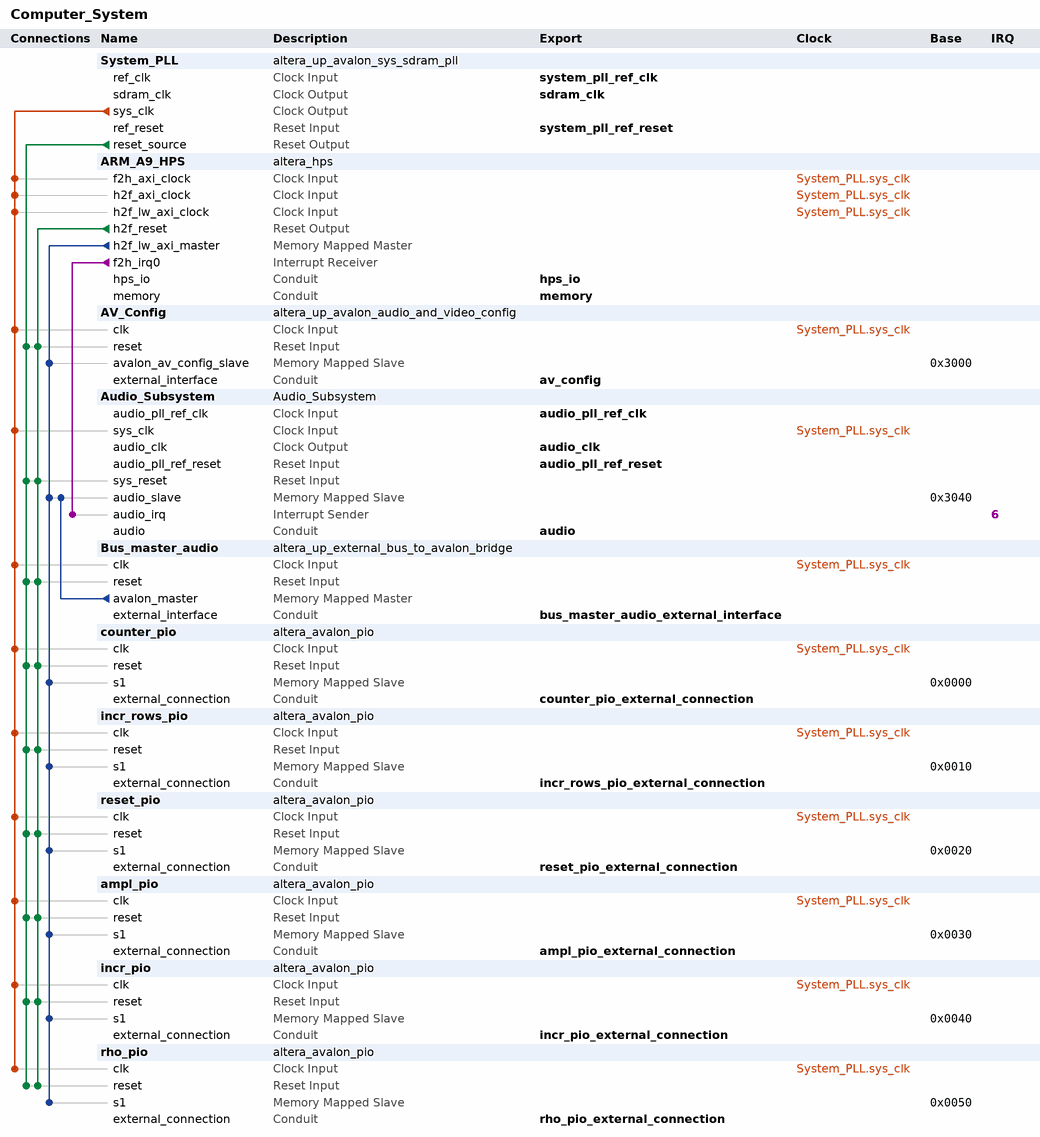
[diagram p0: system contents]
# Platform Designer (Qsys) system Computer_System, Cyclone V 5CSEMA5F31C6
# Parameters at their usual value, and those the tool derives, are not listed.
package require -exact qsys 18.1
create_system Computer_System
set_project_property DEVICE_FAMILY {Cyclone V}
set_project_property DEVICE 5CSEMA5F31C6

add_instance System_PLL altera_up_avalon_sys_sdram_pll 18.0
set_instance_parameter_value System_PLL CV_boards DE1-SoC
set_instance_parameter_value System_PLL gui_outclk 100.0
set_instance_parameter_value System_PLL gui_refclk 50.0

add_instance ARM_A9_HPS altera_hps 18.1
set_instance_parameter_value ARM_A9_HPS EMAC1_Mode RGMII
set_instance_parameter_value ARM_A9_HPS EMAC1_PinMuxing {HPS I/O Set 0}
set_instance_parameter_value ARM_A9_HPS F2SCLK_COLDRST_Enable false
set_instance_parameter_value ARM_A9_HPS F2SCLK_DBGRST_Enable false
set_instance_parameter_value ARM_A9_HPS F2SCLK_WARMRST_Enable false
set_instance_parameter_value ARM_A9_HPS F2SINTERRUPT_Enable true
set_instance_parameter_value ARM_A9_HPS F2S_Width 2
set_instance_parameter_value ARM_A9_HPS FPGA_PERIPHERAL_OUTPUT_CLOCK_FREQ_EMAC0_GTX_CLK 125
set_instance_parameter_value ARM_A9_HPS FPGA_PERIPHERAL_OUTPUT_CLOCK_FREQ_EMAC0_MD_CLK 100.0
set_instance_parameter_value ARM_A9_HPS FPGA_PERIPHERAL_OUTPUT_CLOCK_FREQ_EMAC1_GTX_CLK 125
set_instance_parameter_value ARM_A9_HPS FPGA_PERIPHERAL_OUTPUT_CLOCK_FREQ_EMAC1_MD_CLK 100.0
set_instance_parameter_value ARM_A9_HPS HPS_PROTOCOL DDR3
set_instance_parameter_value ARM_A9_HPS I2C0_Mode I2C
set_instance_parameter_value ARM_A9_HPS I2C0_PinMuxing {HPS I/O Set 0}
set_instance_parameter_value ARM_A9_HPS I2C1_Mode I2C
set_instance_parameter_value ARM_A9_HPS I2C1_PinMuxing {HPS I/O Set 0}
set_instance_parameter_value ARM_A9_HPS LWH2F_Enable true
set_instance_parameter_value ARM_A9_HPS MEM_BANKADDR_WIDTH 3
set_instance_parameter_value ARM_A9_HPS MEM_CLK_FREQ 400.0
set_instance_parameter_value ARM_A9_HPS MEM_COL_ADDR_WIDTH 10
set_instance_parameter_value ARM_A9_HPS MEM_DQ_WIDTH 32
set_instance_parameter_value ARM_A9_HPS MEM_DRV_STR RZQ/7
set_instance_parameter_value ARM_A9_HPS MEM_ROW_ADDR_WIDTH 15
set_instance_parameter_value ARM_A9_HPS MEM_RTT_NOM RZQ/4
set_instance_parameter_value ARM_A9_HPS MEM_RTT_WR RZQ/4
set_instance_parameter_value ARM_A9_HPS MEM_TCL 11
set_instance_parameter_value ARM_A9_HPS MEM_TFAW_NS 30.0
set_instance_parameter_value ARM_A9_HPS MEM_TRAS_NS 35.0
set_instance_parameter_value ARM_A9_HPS MEM_TRCD_NS 13.75
set_instance_parameter_value ARM_A9_HPS MEM_TRFC_NS 260.0
set_instance_parameter_value ARM_A9_HPS MEM_TRP_NS 13.75
set_instance_parameter_value ARM_A9_HPS MEM_VENDOR JEDEC
set_instance_parameter_value ARM_A9_HPS MEM_WTCL 8
set_instance_parameter_value ARM_A9_HPS QSPI_Mode {1 SS}
set_instance_parameter_value ARM_A9_HPS QSPI_PinMuxing {HPS I/O Set 0}
set_instance_parameter_value ARM_A9_HPS REF_CLK_FREQ 25.0
set_instance_parameter_value ARM_A9_HPS S2FCLK_USER2CLK 5
set_instance_parameter_value ARM_A9_HPS S2F_Width 3
set_instance_parameter_value ARM_A9_HPS SDIO_Mode {4-bit Data}
set_instance_parameter_value ARM_A9_HPS SDIO_PinMuxing {HPS I/O Set 0}
set_instance_parameter_value ARM_A9_HPS SPIM1_Mode {Single Slave Select}
set_instance_parameter_value ARM_A9_HPS SPIM1_PinMuxing {HPS I/O Set 0}
set_instance_parameter_value ARM_A9_HPS STM_Enable false
set_instance_parameter_value ARM_A9_HPS TIMING_BOARD_AC_SKEW 0.03
set_instance_parameter_value ARM_A9_HPS TIMING_BOARD_AC_TO_CK_SKEW 0.0
set_instance_parameter_value ARM_A9_HPS TIMING_BOARD_DQ_TO_DQS_SKEW 0.0
set_instance_parameter_value ARM_A9_HPS TIMING_BOARD_MAX_CK_DELAY 0.03
set_instance_parameter_value ARM_A9_HPS TIMING_BOARD_MAX_DQS_DELAY 0.02
set_instance_parameter_value ARM_A9_HPS TIMING_BOARD_SKEW_BETWEEN_DQS 0.08
set_instance_parameter_value ARM_A9_HPS TIMING_BOARD_SKEW_CKDQS_DIMM_MAX 0.16
set_instance_parameter_value ARM_A9_HPS TIMING_BOARD_SKEW_CKDQS_DIMM_MIN 0.09
set_instance_parameter_value ARM_A9_HPS TIMING_BOARD_SKEW_WITHIN_DQS 0.01
set_instance_parameter_value ARM_A9_HPS TIMING_TDH 65
set_instance_parameter_value ARM_A9_HPS TIMING_TDQSCK 255
set_instance_parameter_value ARM_A9_HPS TIMING_TDQSQ 125
set_instance_parameter_value ARM_A9_HPS TIMING_TDS 30
set_instance_parameter_value ARM_A9_HPS TIMING_TIH 140
set_instance_parameter_value ARM_A9_HPS TIMING_TIS 180
set_instance_parameter_value ARM_A9_HPS TIMING_TQSH 0.4
set_instance_parameter_value ARM_A9_HPS UART0_Mode {No Flow Control}
set_instance_parameter_value ARM_A9_HPS UART0_PinMuxing {HPS I/O Set 0}
set_instance_parameter_value ARM_A9_HPS USB1_Mode SDR
set_instance_parameter_value ARM_A9_HPS USB1_PinMuxing {HPS I/O Set 0}
set_instance_parameter_value ARM_A9_HPS desired_cfg_clk_mhz 100.0
set_instance_parameter_value ARM_A9_HPS desired_qspi_clk_mhz 400.0

add_instance AV_Config altera_up_avalon_audio_and_video_config 18.0
set_instance_parameter_value AV_Config audio_in {Line In to ADC}
set_instance_parameter_value AV_Config bit_length 16
set_instance_parameter_value AV_Config board DE1-SoC
set_instance_parameter_value AV_Config line_in_bypass false
set_instance_parameter_value AV_Config sampling_rate {48 kHz}

add_instance Audio_Subsystem Audio_Subsystem 1.0

add_instance Bus_master_audio altera_up_external_bus_to_avalon_bridge 18.0
set_instance_parameter_value Bus_master_audio addr_size 64
set_instance_parameter_value Bus_master_audio addr_size_multiplier Kbytes
set_instance_parameter_value Bus_master_audio data_size 32

add_instance counter_pio altera_avalon_pio 18.1
set_instance_parameter_value counter_pio direction Output
set_instance_parameter_value counter_pio width 32

add_instance incr_rows_pio altera_avalon_pio 18.1
set_instance_parameter_value incr_rows_pio direction Output
set_instance_parameter_value incr_rows_pio width 32

add_instance reset_pio altera_avalon_pio 18.1
set_instance_parameter_value reset_pio direction Output
set_instance_parameter_value reset_pio width 32

add_instance ampl_pio altera_avalon_pio 18.1
set_instance_parameter_value ampl_pio direction Output
set_instance_parameter_value ampl_pio width 32

add_instance incr_pio altera_avalon_pio 18.1
set_instance_parameter_value incr_pio direction Output
set_instance_parameter_value incr_pio width 32

add_instance rho_pio altera_avalon_pio 18.1
set_instance_parameter_value rho_pio direction Output
set_instance_parameter_value rho_pio width 32

# connections
add_connection System_PLL.sys_clk ampl_pio.clk clock
add_connection System_PLL.sys_clk ARM_A9_HPS.f2h_axi_clock clock
add_connection System_PLL.sys_clk ARM_A9_HPS.h2f_axi_clock clock
add_connection System_PLL.sys_clk ARM_A9_HPS.h2f_lw_axi_clock clock
add_connection System_PLL.sys_clk Audio_Subsystem.sys_clk clock
add_connection System_PLL.sys_clk AV_Config.clk clock
add_connection System_PLL.sys_clk Bus_master_audio.clk clock
add_connection System_PLL.sys_clk counter_pio.clk clock
add_connection System_PLL.sys_clk incr_pio.clk clock
add_connection System_PLL.sys_clk incr_rows_pio.clk clock
add_connection System_PLL.sys_clk reset_pio.clk clock
add_connection System_PLL.sys_clk rho_pio.clk clock
add_connection ARM_A9_HPS.h2f_reset ampl_pio.reset reset
add_connection ARM_A9_HPS.h2f_reset Audio_Subsystem.sys_reset reset
add_connection ARM_A9_HPS.h2f_reset AV_Config.reset reset
add_connection ARM_A9_HPS.h2f_reset Bus_master_audio.reset reset
add_connection ARM_A9_HPS.h2f_reset counter_pio.reset reset
add_connection ARM_A9_HPS.h2f_reset incr_pio.reset reset
add_connection ARM_A9_HPS.h2f_reset incr_rows_pio.reset reset
add_connection ARM_A9_HPS.h2f_reset reset_pio.reset reset
add_connection ARM_A9_HPS.h2f_reset rho_pio.reset reset
add_connection System_PLL.reset_source ampl_pio.reset reset
add_connection System_PLL.reset_source Audio_Subsystem.sys_reset reset
add_connection System_PLL.reset_source AV_Config.reset reset
add_connection System_PLL.reset_source Bus_master_audio.reset reset
add_connection System_PLL.reset_source counter_pio.reset reset
add_connection System_PLL.reset_source incr_pio.reset reset
add_connection System_PLL.reset_source incr_rows_pio.reset reset
add_connection System_PLL.reset_source reset_pio.reset reset
add_connection System_PLL.reset_source rho_pio.reset reset
add_connection ARM_A9_HPS.h2f_lw_axi_master ampl_pio.s1 avalon
set_connection_parameter_value ARM_A9_HPS.h2f_lw_axi_master/ampl_pio.s1 baseAddress 0x0030
add_connection ARM_A9_HPS.h2f_lw_axi_master Audio_Subsystem.audio_slave avalon
set_connection_parameter_value ARM_A9_HPS.h2f_lw_axi_master/Audio_Subsystem.audio_slave baseAddress 0x3040
add_connection ARM_A9_HPS.h2f_lw_axi_master AV_Config.avalon_av_config_slave avalon
set_connection_parameter_value ARM_A9_HPS.h2f_lw_axi_master/AV_Config.avalon_av_config_slave baseAddress 0x3000
add_connection ARM_A9_HPS.h2f_lw_axi_master counter_pio.s1 avalon
set_connection_parameter_value ARM_A9_HPS.h2f_lw_axi_master/counter_pio.s1 baseAddress 0x0000
add_connection ARM_A9_HPS.h2f_lw_axi_master incr_pio.s1 avalon
set_connection_parameter_value ARM_A9_HPS.h2f_lw_axi_master/incr_pio.s1 baseAddress 0x0040
add_connection ARM_A9_HPS.h2f_lw_axi_master incr_rows_pio.s1 avalon
set_connection_parameter_value ARM_A9_HPS.h2f_lw_axi_master/incr_rows_pio.s1 baseAddress 0x0010
add_connection ARM_A9_HPS.h2f_lw_axi_master reset_pio.s1 avalon
set_connection_parameter_value ARM_A9_HPS.h2f_lw_axi_master/reset_pio.s1 baseAddress 0x0020
add_connection ARM_A9_HPS.h2f_lw_axi_master rho_pio.s1 avalon
set_connection_parameter_value ARM_A9_HPS.h2f_lw_axi_master/rho_pio.s1 baseAddress 0x0050
add_connection Bus_master_audio.avalon_master Audio_Subsystem.audio_slave avalon
set_connection_parameter_value Bus_master_audio.avalon_master/Audio_Subsystem.audio_slave baseAddress 0x3040
add_connection ARM_A9_HPS.f2h_irq0 Audio_Subsystem.audio_irq interrupt
set_connection_parameter_value ARM_A9_HPS.f2h_irq0/Audio_Subsystem.audio_irq irqNumber 6

# exported interfaces
add_interface ampl_pio_external_connection conduit end
set_interface_property ampl_pio_external_connection EXPORT_OF ampl_pio.external_connection
add_interface audio conduit end
set_interface_property audio EXPORT_OF Audio_Subsystem.audio
add_interface audio_clk clock source
set_interface_property audio_clk EXPORT_OF Audio_Subsystem.audio_clk
add_interface audio_pll_ref_clk clock sink
set_interface_property audio_pll_ref_clk EXPORT_OF Audio_Subsystem.audio_pll_ref_clk
add_interface audio_pll_ref_reset reset sink
set_interface_property audio_pll_ref_reset EXPORT_OF Audio_Subsystem.audio_pll_ref_reset
add_interface av_config conduit end
set_interface_property av_config EXPORT_OF AV_Config.external_interface
add_interface bus_master_audio_external_interface conduit end
set_interface_property bus_master_audio_external_interface EXPORT_OF Bus_master_audio.external_interface
add_interface counter_pio_external_connection conduit end
set_interface_property counter_pio_external_connection EXPORT_OF counter_pio.external_connection
add_interface hps_io conduit end
set_interface_property hps_io EXPORT_OF ARM_A9_HPS.hps_io
add_interface incr_pio_external_connection conduit end
set_interface_property incr_pio_external_connection EXPORT_OF incr_pio.external_connection
add_interface incr_rows_pio_external_connection conduit end
set_interface_property incr_rows_pio_external_connection EXPORT_OF incr_rows_pio.external_connection
add_interface memory conduit end
set_interface_property memory EXPORT_OF ARM_A9_HPS.memory
add_interface reset_pio_external_connection conduit end
set_interface_property reset_pio_external_connection EXPORT_OF reset_pio.external_connection
add_interface rho_pio_external_connection conduit end
set_interface_property rho_pio_external_connection EXPORT_OF rho_pio.external_connection
add_interface sdram_clk clock source
set_interface_property sdram_clk EXPORT_OF System_PLL.sdram_clk
add_interface system_pll_ref_clk clock sink
set_interface_property system_pll_ref_clk EXPORT_OF System_PLL.ref_clk
add_interface system_pll_ref_reset reset sink
set_interface_property system_pll_ref_reset EXPORT_OF System_PLL.ref_reset

set_interconnect_requirement {$system} qsys_mm.clockCrossingAdapter HANDSHAKE
set_interconnect_requirement {$system} qsys_mm.enableEccProtection FALSE
set_interconnect_requirement {$system} qsys_mm.insertDefaultSlave FALSE
set_interconnect_requirement {$system} qsys_mm.maxAdditionalLatency 1

save_system Computer_System.qsys
